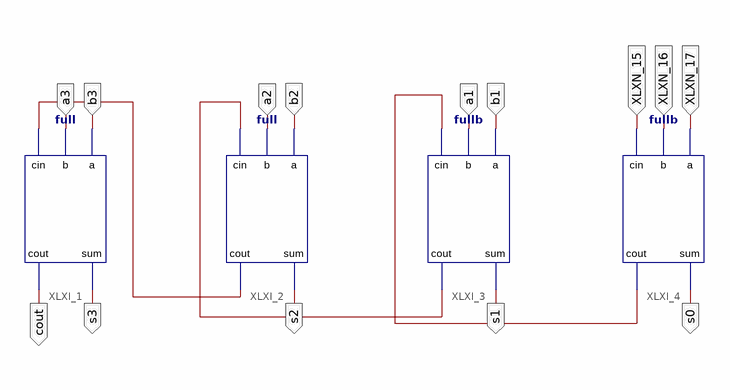
[diagram p0: schematic sheet 1]
// Xilinx ISE schematic fourbit.sch (spartan3) as structural Verilog: 4 symbols, 14 ports
module fourbit (
  input  a3,
  input  b3,
  input  a2,
  input  b2,
  input  a1,
  input  b1,
  input  XLXN_15,
  input  XLXN_16,
  input  XLXN_17,
  output cout,
  output s3,
  output s2,
  output s1,
  output s0
);

  wire XLXN_1, XLXN_2, XLXN_3;

  full XLXI_1 (.a(b3), .b(a3), .cin(XLXN_3), .sum(s3), .cout(cout));
  full XLXI_2 (.a(b2), .b(a2), .cin(XLXN_2), .sum(s2), .cout(XLXN_3));
  fullb XLXI_3 (.a(b1), .b(a1), .cin(XLXN_1), .sum(s1), .cout(XLXN_2));
  fullb XLXI_4 (.a(XLXN_17), .b(XLXN_16), .cin(XLXN_15), .sum(s0), .cout(XLXN_1));
endmodule
